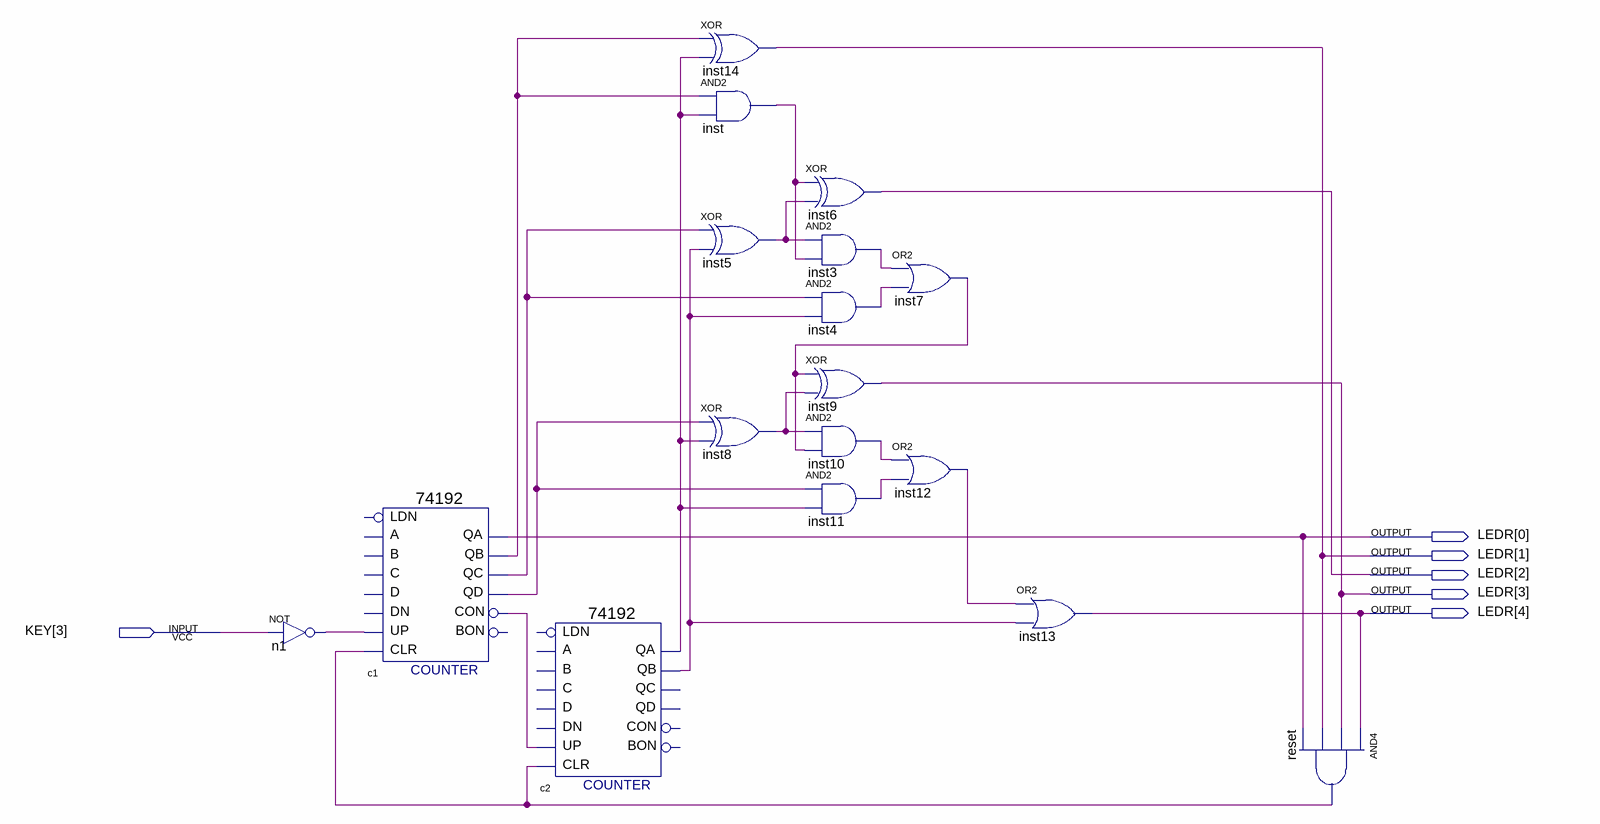
[diagram p0: schematic sheet]
// Quartus schematic 74192mod27 — kopia.bdf as structural Verilog: 17 symbols, 6 pins
module \74192mod27_—_kopia  (
  input  [3:3] KEY,
  output [4:0] LEDR
);

  wire c1_con, c1_qb, c1_qc, c1_qd, c2_qa, c2_qb, inst3_out, inst4_out, inst5_out, inst7_out, inst8_out,
       inst10_out, inst11_out, inst12_out, inst_out, n1_out, reset_out;

  not n1 (n1_out, KEY[3]);
  \74192  c1 (
    .CLR(reset_out), .UP(n1_out), .QB(c1_qb), .CON(c1_con), .QA(LEDR[0]), .QC(c1_qc), .QD(c1_qd));  // open: D, C, A, B, DN, LDN, BON
  \74192  c2 (.CLR(reset_out), .UP(c1_con), .QB(c2_qb), .QA(c2_qa));  // open: D, C, A, B, DN, LDN, BON, CON, QC, QD
  xor inst14 (LEDR[1], c1_qb, c2_qa);
  and inst (inst_out, c1_qb, c2_qa);
  xor inst5 (inst5_out, c1_qc, c2_qb);
  xor inst8 (inst8_out, c1_qd, c2_qa);
  xor inst6 (LEDR[2], inst_out, inst5_out);
  and inst3 (inst3_out, inst5_out, inst_out);
  and inst4 (inst4_out, c1_qc, c2_qb);
  xor inst9 (LEDR[3], inst7_out, inst8_out);
  and inst10 (inst10_out, inst8_out, inst7_out);
  and inst11 (inst11_out, c1_qd, c2_qa);
  or inst7 (inst7_out, inst3_out, inst4_out);
  or inst12 (inst12_out, inst10_out, inst11_out);
  or inst13 (LEDR[4], inst12_out, c2_qb);
  and reset (reset_out, LEDR[4], LEDR[3], LEDR[1], LEDR[0]);
endmodule
